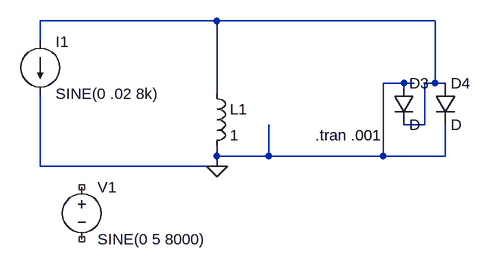
[diagram p0: schematic current_driven_antenna_no_esd.asc]
current_driven_antenna_no_esd.asc, the LTspice schematic file:
Version 4
SHEET 1 880 680
WIRE 416 80 144 80
WIRE 752 80 416 80
WIRE 144 112 144 80
WIRE 704 176 672 176
WIRE 720 176 704 176
WIRE 752 176 752 80
WIRE 752 176 736 176
WIRE 768 176 752 176
WIRE 416 192 416 80
WIRE 736 240 736 176
WIRE 736 240 704 240
WIRE 416 288 416 272
WIRE 496 288 496 240
WIRE 496 288 416 288
WIRE 672 288 672 176
WIRE 672 288 496 288
WIRE 768 288 768 240
WIRE 768 288 672 288
WIRE 144 304 144 192
WIRE 416 304 416 288
WIRE 416 304 144 304
FLAG 416 304 0
SYMBOL ind 400 176 R0
SYMATTR InstName L1
SYMATTR Value 1
SYMATTR SpiceLine Rser=1
SYMBOL voltage 208 320 R0
SYMATTR InstName V1
SYMATTR Value SINE(0 5 8000)
SYMBOL diode 688 176 R0
SYMATTR InstName D3
SYMBOL diode 752 176 R0
SYMATTR InstName D4
SYMBOL current 144 112 R0
SYMATTR InstName I1
SYMATTR Value SINE(0 .02 8k)
TEXT 568 256 Left 2 !.tran .001

The netlist it stands for:
* current_driven_antenna_no_esd.asc
L1 N001 0 1 Rser=1
V1 NC_01 NC_02 SINE(0 5 8000)
D3 0 N001 D
D4 N001 0 D
I1 N001 0 SINE(0 .02 8k)
.model D D
.lib standard.dio
.tran .001
.backanno
.end